# Altium schematic sheet 03_Bank13_Bank34_Bank35.SchDoc
size A3
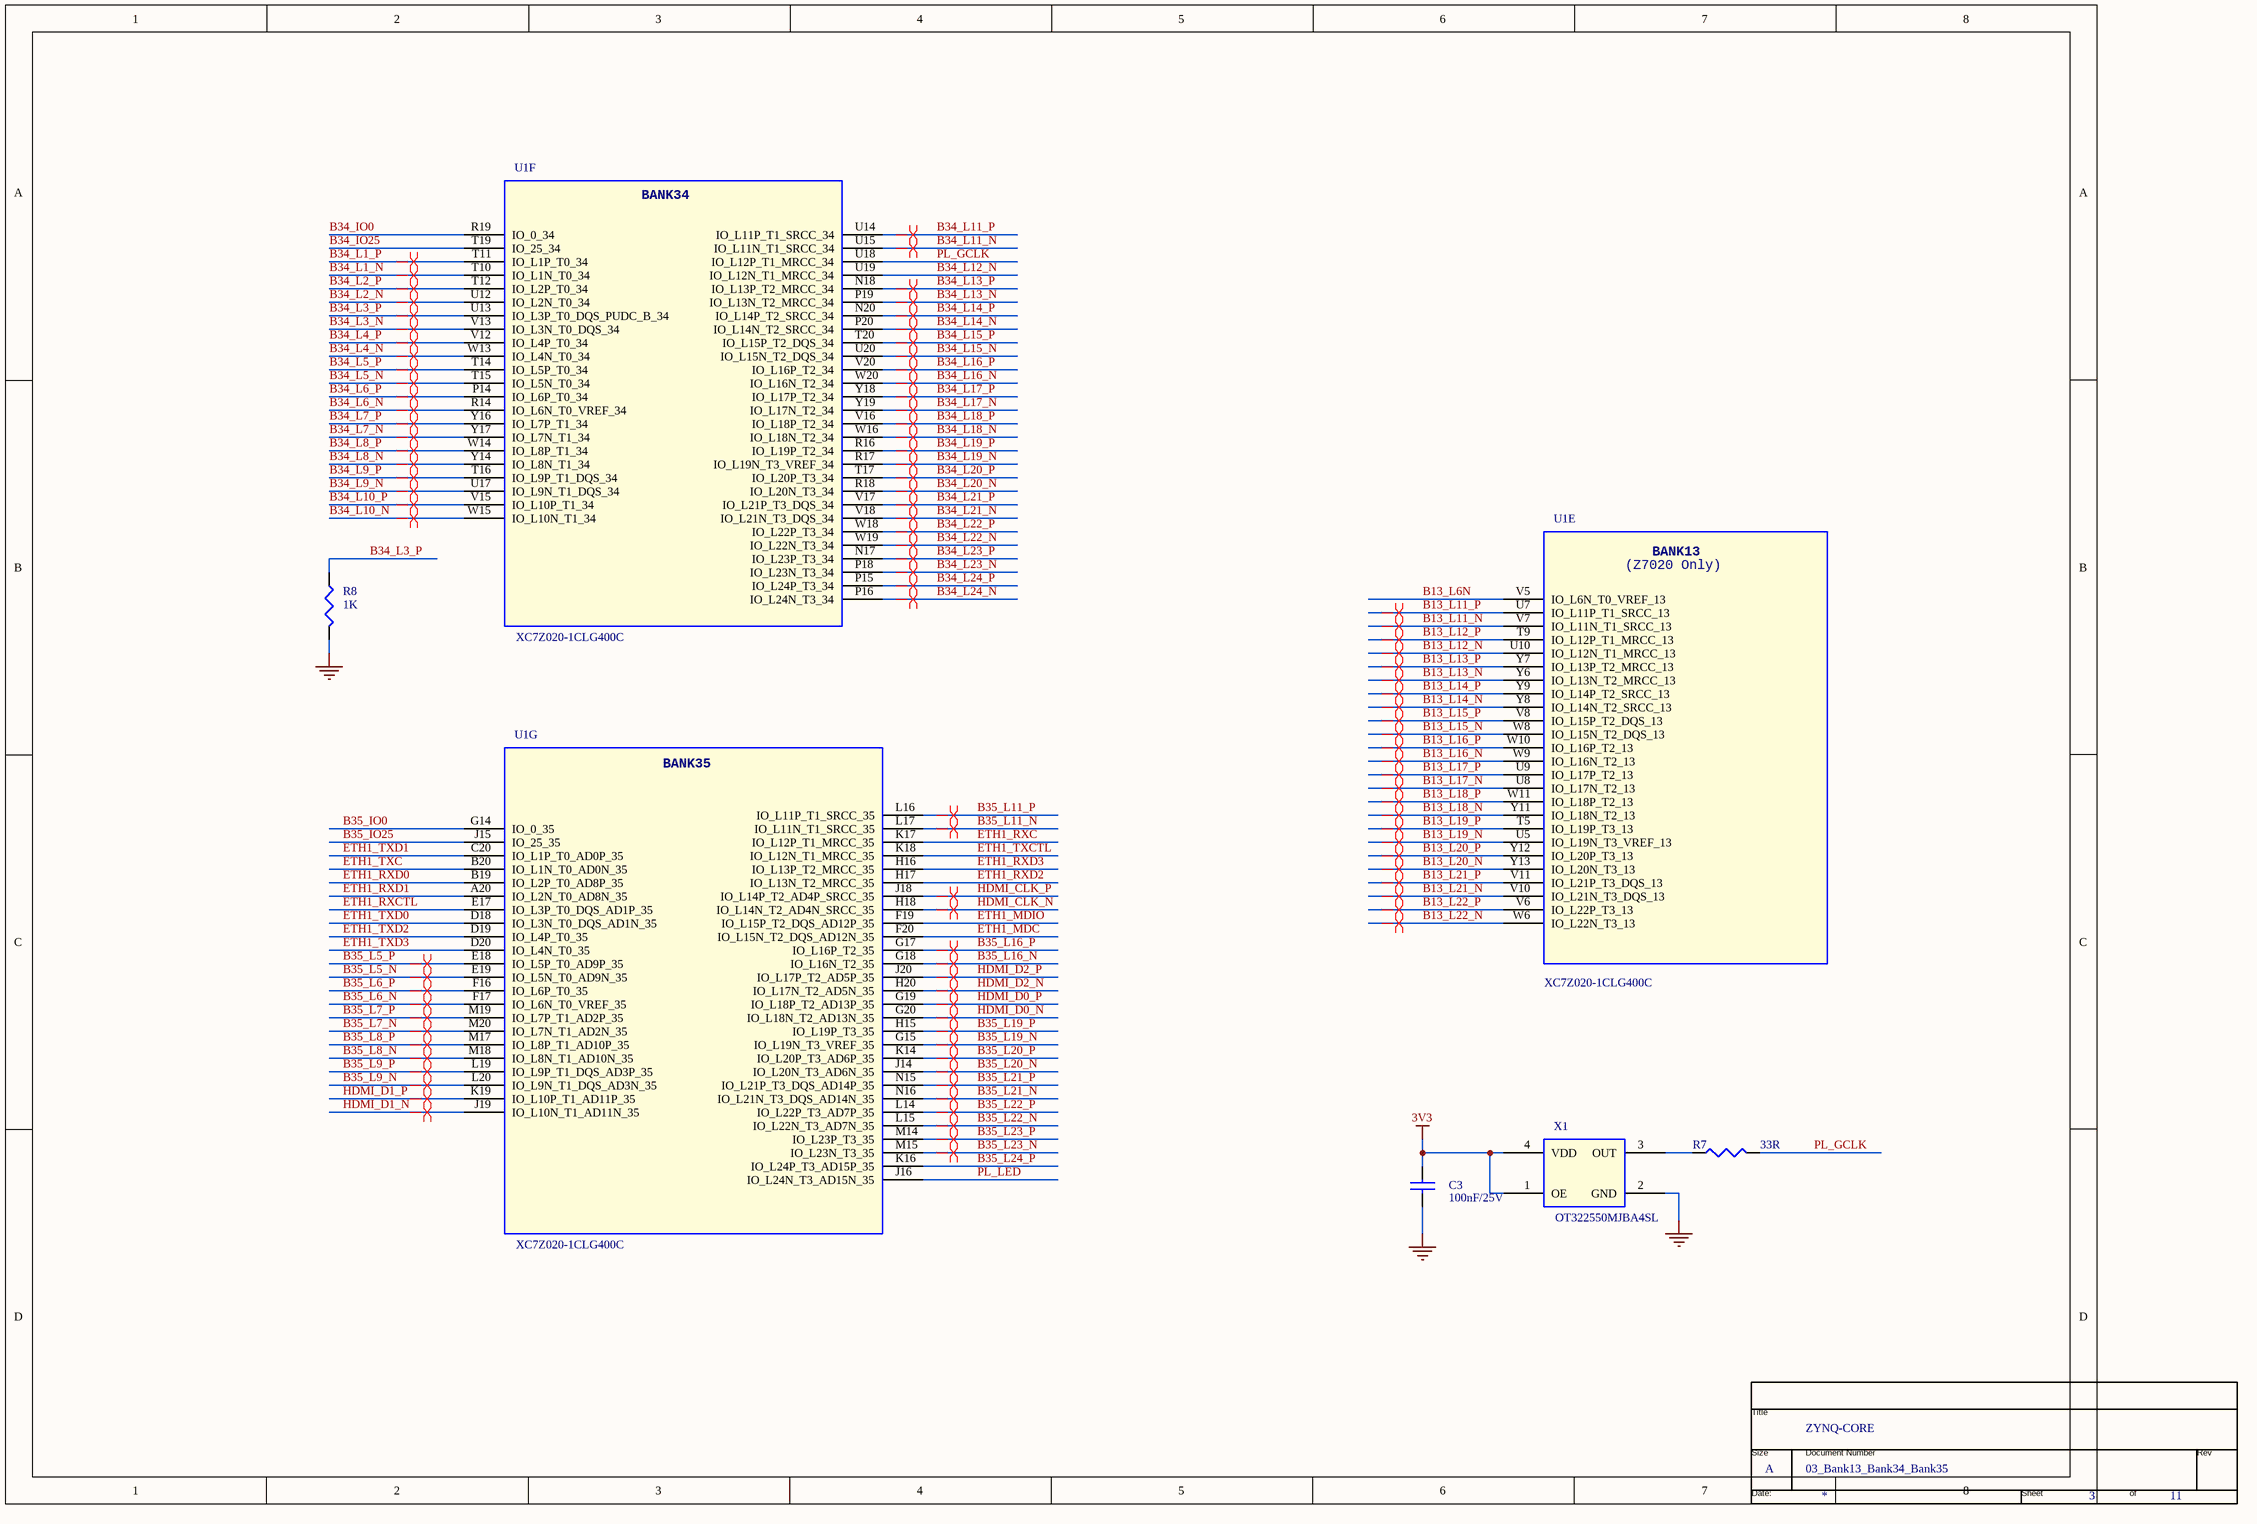
[diagram p0: 03_Bank13_Bank34_Bank35.SchDoc]

## Parts
*  Page Count: 11  Page Number: 3  Page Size: A  Title: ZYNQ-CORE  Doc: 03_Bank13_Bank34_Bank35  (hidden comment: TitleBlock0)  (graphical)
C3  100nF/25V  [C0402]
R7  33R  [R0402]
R8  1K  [R0402A]
U1  XC7Z020-1CLG400C  [CLG400]  (parts E,F,G of 9)
X1  OT322550MJBA4SL  [OSC3_2X2_5]

## Nets
3V3: C3.1 X1.1(OE) X1.4(VDD)
GND: C3.2 R8.2 X1.2(GND)
B13_L6N: U1.V5(IO_L6N_T0_VREF_13)
B13_L11_N: U1.V7(IO_L11N_T1_SRCC_13)
B13_L11_P: U1.U7(IO_L11P_T1_SRCC_13)
B13_L12_N: U1.U10(IO_L12N_T1_MRCC_13)
B13_L12_P: U1.T9(IO_L12P_T1_MRCC_13)
B13_L13_N: U1.Y6(IO_L13N_T2_MRCC_13)
B13_L13_P: U1.Y7(IO_L13P_T2_MRCC_13)
B13_L14_N: U1.Y8(IO_L14N_T2_SRCC_13)
B13_L14_P: U1.Y9(IO_L14P_T2_SRCC_13)
B13_L15_N: U1.W8(IO_L15N_T2_DQS_13)
B13_L15_P: U1.V8(IO_L15P_T2_DQS_13)
B13_L16_N: U1.W9(IO_L16N_T2_13)
B13_L16_P: U1.W10(IO_L16P_T2_13)
B13_L17_N: U1.U8(IO_L17N_T2_13)
B13_L17_P: U1.U9(IO_L17P_T2_13)
B13_L18_N: U1.Y11(IO_L18N_T2_13)
B13_L18_P: U1.W11(IO_L18P_T2_13)
B13_L19_N: U1.U5(IO_L19N_T3_VREF_13)
B13_L19_P: U1.T5(IO_L19P_T3_13)
B13_L20_N: U1.Y13(IO_L20N_T3_13)
B13_L20_P: U1.Y12(IO_L20P_T3_13)
B13_L21_N: U1.V10(IO_L21N_T3_DQS_13)
B13_L21_P: U1.V11(IO_L21P_T3_DQS_13)
B13_L22_N: U1.W6(IO_L22N_T3_13)
B13_L22_P: U1.V6(IO_L22P_T3_13)
B34_IO0: U1.R19(IO_0_34)
B34_IO25: U1.T19(IO_25_34)
B34_L1_N: U1.T10(IO_L1N_T0_34)
B34_L1_P: U1.T11(IO_L1P_T0_34)
B34_L2_N: U1.U12(IO_L2N_T0_34)
B34_L2_P: U1.T12(IO_L2P_T0_34)
B34_L3_N: U1.V13(IO_L3N_T0_DQS_34)
B34_L3_P: R8.1 U1.U13(IO_L3P_T0_DQS_PUDC_B_34)
B34_L4_N: U1.W13(IO_L4N_T0_34)
B34_L4_P: U1.V12(IO_L4P_T0_34)
B34_L5_N: U1.T15(IO_L5N_T0_34)
B34_L5_P: U1.T14(IO_L5P_T0_34)
B34_L6_N: U1.R14(IO_L6N_T0_VREF_34)
B34_L6_P: U1.P14(IO_L6P_T0_34)
B34_L7_N: U1.Y17(IO_L7N_T1_34)
B34_L7_P: U1.Y16(IO_L7P_T1_34)
B34_L8_N: U1.Y14(IO_L8N_T1_34)
B34_L8_P: U1.W14(IO_L8P_T1_34)
B34_L9_N: U1.U17(IO_L9N_T1_DQS_34)
B34_L9_P: U1.T16(IO_L9P_T1_DQS_34)
B34_L10_N: U1.W15(IO_L10N_T1_34)
B34_L10_P: U1.V15(IO_L10P_T1_34)
B34_L11_N: U1.U15(IO_L11N_T1_SRCC_34)
B34_L11_P: U1.U14(IO_L11P_T1_SRCC_34)
B34_L12_N: U1.U19(IO_L12N_T1_MRCC_34)
B34_L13_N: U1.P19(IO_L13N_T2_MRCC_34)
B34_L13_P: U1.N18(IO_L13P_T2_MRCC_34)
B34_L14_N: U1.P20(IO_L14N_T2_SRCC_34)
B34_L14_P: U1.N20(IO_L14P_T2_SRCC_34)
B34_L15_N: U1.U20(IO_L15N_T2_DQS_34)
B34_L15_P: U1.T20(IO_L15P_T2_DQS_34)
B34_L16_N: U1.W20(IO_L16N_T2_34)
B34_L16_P: U1.V20(IO_L16P_T2_34)
B34_L17_N: U1.Y19(IO_L17N_T2_34)
B34_L17_P: U1.Y18(IO_L17P_T2_34)
B34_L18_N: U1.W16(IO_L18N_T2_34)
B34_L18_P: U1.V16(IO_L18P_T2_34)
B34_L19_N: U1.R17(IO_L19N_T3_VREF_34)
B34_L19_P: U1.R16(IO_L19P_T2_34)
B34_L20_N: U1.R18(IO_L20N_T3_34)
B34_L20_P: U1.T17(IO_L20P_T3_34)
B34_L21_N: U1.V18(IO_L21N_T3_DQS_34)
B34_L21_P: U1.V17(IO_L21P_T3_DQS_34)
B34_L22_N: U1.W19(IO_L22N_T3_34)
B34_L22_P: U1.W18(IO_L22P_T3_34)
B34_L23_N: U1.P18(IO_L23N_T3_34)
B34_L23_P: U1.N17(IO_L23P_T3_34)
B34_L24_N: U1.P16(IO_L24N_T3_34)
B34_L24_P: U1.P15(IO_L24P_T3_34)
B35_IO0: U1.G14(IO_0_35)
B35_IO25: U1.J15(IO_25_35)
B35_L5_N: U1.E19(IO_L5N_T0_AD9N_35)
B35_L5_P: U1.E18(IO_L5P_T0_AD9P_35)
B35_L6_N: U1.F17(IO_L6N_T0_VREF_35)
B35_L6_P: U1.F16(IO_L6P_T0_35)
B35_L7_N: U1.M20(IO_L7N_T1_AD2N_35)
B35_L7_P: U1.M19(IO_L7P_T1_AD2P_35)
B35_L8_N: U1.M18(IO_L8N_T1_AD10N_35)
B35_L8_P: U1.M17(IO_L8P_T1_AD10P_35)
B35_L9_N: U1.L20(IO_L9N_T1_DQS_AD3N_35)
B35_L9_P: U1.L19(IO_L9P_T1_DQS_AD3P_35)
B35_L11_N: U1.L17(IO_L11N_T1_SRCC_35)
B35_L11_P: U1.L16(IO_L11P_T1_SRCC_35)
B35_L16_N: U1.G18(IO_L16N_T2_35)
B35_L16_P: U1.G17(IO_L16P_T2_35)
B35_L19_N: U1.G15(IO_L19N_T3_VREF_35)
B35_L19_P: U1.H15(IO_L19P_T3_35)
B35_L20_N: U1.J14(IO_L20N_T3_AD6N_35)
B35_L20_P: U1.K14(IO_L20P_T3_AD6P_35)
B35_L21_N: U1.N16(IO_L21N_T3_DQS_AD14N_35)
B35_L21_P: U1.N15(IO_L21P_T3_DQS_AD14P_35)
B35_L22_N: U1.L15(IO_L22N_T3_AD7N_35)
B35_L22_P: U1.L14(IO_L22P_T3_AD7P_35)
B35_L23_N: U1.M15(IO_L23N_T3_35)
B35_L23_P: U1.M14(IO_L23P_T3_35)
B35_L24_P: U1.K16(IO_L24P_T3_AD15P_35)
ETH1_MDC: U1.F20(IO_L15N_T2_DQS_AD12N_35)
ETH1_MDIO: U1.F19(IO_L15P_T2_DQS_AD12P_35)
ETH1_RXC: U1.K17(IO_L12P_T1_MRCC_35)
ETH1_RXCTL: U1.E17(IO_L3P_T0_DQS_AD1P_35)
ETH1_RXD0: U1.B19(IO_L2P_T0_AD8P_35)
ETH1_RXD1: U1.A20(IO_L2N_T0_AD8N_35)
ETH1_RXD2: U1.H17(IO_L13N_T2_MRCC_35)
ETH1_RXD3: U1.H16(IO_L13P_T2_MRCC_35)
ETH1_TXC: U1.B20(IO_L1N_T0_AD0N_35)
ETH1_TXCTL: U1.K18(IO_L12N_T1_MRCC_35)
ETH1_TXD0: U1.D18(IO_L3N_T0_DQS_AD1N_35)
ETH1_TXD1: U1.C20(IO_L1P_T0_AD0P_35)
ETH1_TXD2: U1.D19(IO_L4P_T0_35)
ETH1_TXD3: U1.D20(IO_L4N_T0_35)
HDMI_CLK_N: U1.H18(IO_L14N_T2_AD4N_SRCC_35)
HDMI_CLK_P: U1.J18(IO_L14P_T2_AD4P_SRCC_35)
HDMI_D0_N: U1.G20(IO_L18N_T2_AD13N_35)
HDMI_D0_P: U1.G19(IO_L18P_T2_AD13P_35)
HDMI_D1_N: U1.J19(IO_L10N_T1_AD11N_35)
HDMI_D1_P: U1.K19(IO_L10P_T1_AD11P_35)
HDMI_D2_N: U1.H20(IO_L17N_T2_AD5N_35)
HDMI_D2_P: U1.J20(IO_L17P_T2_AD5P_35)
PL_GCLK: R7.2 U1.U18(IO_L12P_T1_MRCC_34)
PL_LED: U1.J16(IO_L24N_T3_AD15N_35)
NetR7_1: R7.1 X1.3(OUT)

## Layout directives
differential pair: B13_L11_N, B13_L11_P, B13_L12_N, B13_L12_P, B13_L13_N, B13_L13_P, B13_L14_N, B13_L14_P, B13_L15_N, B13_L15_P, B13_L16_N, B13_L16_P, B13_L17_N, B13_L17_P, B13_L18_N, B13_L18_P, B13_L19_N, B13_L19_P, B13_L20_N, B13_L20_P, B13_L21_N, B13_L21_P, B13_L22_N, B13_L22_P, B34_L1_N, B34_L1_P, B34_L2_N, B34_L2_P, B34_L3_N, B34_L3_P, B34_L4_N, B34_L4_P, B34_L5_N, B34_L5_P, B34_L6_N, B34_L6_P, B34_L7_N, B34_L7_P, B34_L8_N, B34_L8_P, B34_L9_N, B34_L9_P, B34_L10_N, B34_L10_P, B34_L11_N, B34_L11_P, B34_L13_N, B34_L13_P, B34_L14_N, B34_L14_P, B34_L15_N, B34_L15_P, B34_L16_N, B34_L16_P, B34_L17_N, B34_L17_P, B34_L18_N, B34_L18_P, B34_L19_N, B34_L19_P, B34_L20_N, B34_L20_P, B34_L21_N, B34_L21_P, B34_L22_N, B34_L22_P, B34_L23_N, B34_L23_P, B34_L24_N, B34_L24_P, B35_L5_N, B35_L5_P, B35_L6_N, B35_L6_P, B35_L7_N, B35_L7_P, B35_L8_N, B35_L8_P, B35_L9_N, B35_L9_P, B35_L11_N, B35_L11_P, B35_L16_N, B35_L16_P, B35_L19_N, B35_L19_P, B35_L20_N, B35_L20_P, B35_L21_N, B35_L21_P, B35_L22_N, B35_L22_P, B35_L23_N, B35_L23_P, HDMI_CLK_N, HDMI_CLK_P, HDMI_D0_N, HDMI_D0_P, HDMI_D1_N, HDMI_D1_P, HDMI_D2_N, HDMI_D2_P

## Notes on the sheet
- (in symbol TitleBlock0) Title; Size; Document Number; Rev; Date:; Sheet; of
- (in symbol Zynq7010/7020, part E) BANK13; (Z7020 Only)
- (in symbol Zynq7010/7020, part F) BANK34
- (in symbol Zynq7010/7020, part G) BANK35

## Library data of the parts
C3 = CAP NP_Dup1: PCB Footprint: C0402
R7 = RESISTOR_Dup1: PCB Footprint: R0402
R8 = RESISTOR_Dup1: PCB Footprint: R0402
U1 = Zynq7010/7020: PCB Footprint: CLG400
X1 = crystal_active: 50MHZ; PCB Footprint: OSC3_2X2_5
* = TitleBlock0: Page Create Date: March  8, 1995; Page Modify Date: *